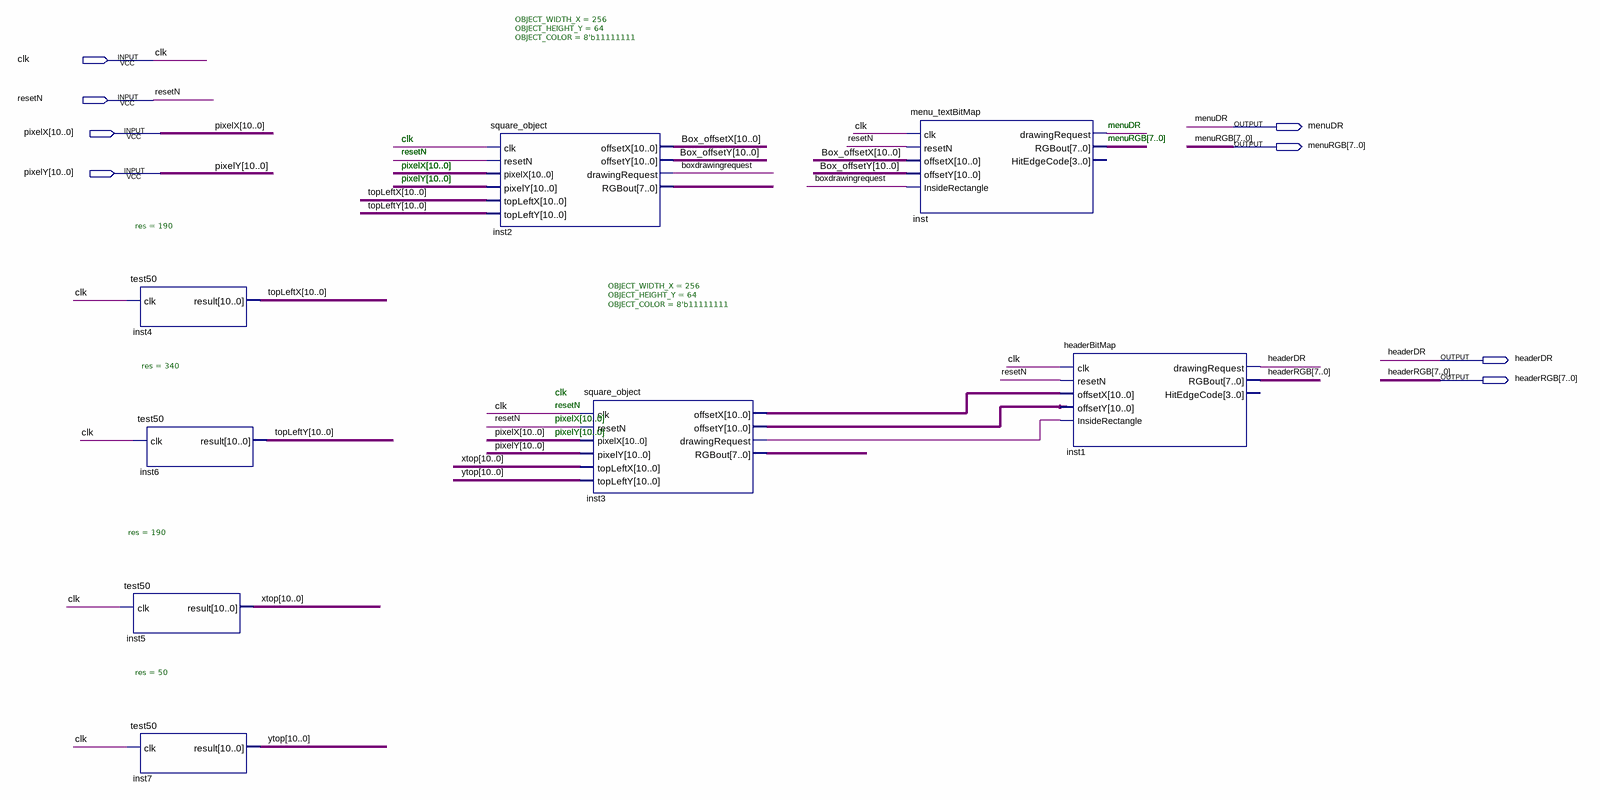
[diagram p0: schematic sheet]
// Quartus schematic menu_block.bdf as structural Verilog: 8 symbols, 8 pins
module menu_block (
  input  clk,
  input  resetN,
  input  [10:0] pixelX,
  input  [10:0] pixelY,
  output menuDR,
  output [7:0] menuRGB,
  output headerDR,
  output [7:0] headerRGB
);

  wire boxdrawingrequest, inst3_drawingrequest;
  wire [7:0] inst2_rgbout, inst3_rgbout;
  wire [10:0] Box_offsetX, Box_offsetY, inst3_offsetx, inst3_offsety, topLeftX, topLeftY, xtop, ytop;

  test50 #(.res(190)) inst4 (.clk(clk), .result(topLeftX));
  test50 #(.res(340)) inst6 (.clk(clk), .result(topLeftY));
  test50 #(.res(190)) inst5 (.clk(clk), .result(xtop));
  test50 #(.res(50)) inst7 (.clk(clk), .result(ytop));
  square_object #(.OBJECT_WIDTH_X(256), .OBJECT_HEIGHT_Y(64), .OBJECT_COLOR(8'b11111111)) inst2 (
    .clk(clk), .resetN(resetN), .pixelX(pixelX), .pixelY(pixelY), .topLeftX(topLeftX), .topLeftY(topLeftY),
    .offsetX(Box_offsetX), .offsetY(Box_offsetY), .drawingRequest(boxdrawingrequest), .RGBout(inst2_rgbout));
  square_object #(.OBJECT_WIDTH_X(256), .OBJECT_HEIGHT_Y(64), .OBJECT_COLOR(8'b11111111)) inst3 (
    .clk(clk), .resetN(resetN), .pixelX(pixelX), .pixelY(pixelY), .topLeftX(xtop), .topLeftY(ytop),
    .offsetX(inst3_offsetx), .offsetY(inst3_offsety), .drawingRequest(inst3_drawingrequest),
    .RGBout(inst3_rgbout));
  menu_textBitMap inst (
    .clk(clk), .resetN(resetN), .offsetX(Box_offsetX), .offsetY(Box_offsetY),
    .InsideRectangle(boxdrawingrequest), .drawingRequest(menuDR), .RGBout(menuRGB));  // open: HitEdgeCode
  headerBitMap inst1 (
    .clk(clk), .resetN(resetN), .offsetX(inst3_offsetx), .offsetY(inst3_offsety),
    .InsideRectangle(inst3_drawingrequest), .drawingRequest(headerDR), .RGBout(headerRGB));  // open: HitEdgeCode

  // Notes on the sheet:
  //   menuDR
  //   clk
  //   clk
  //   menuRGB[7..0]
  //   resetN
  //   resetN
  //   pixelX[10..0]
  //   pixelX[10..0]
  //   pixelY[10..0]
  //   pixelY[10..0]
  //   clk
  //   clk
  //   resetN
  //   resetN
  //   pixelX[10..0]
  //   pixelX[10..0]
  //   pixelY[10..0]
  //   pixelY[10..0]
endmodule
